# Altium schematic sheet 原理圖.schdoc
size 420 x 410 mm
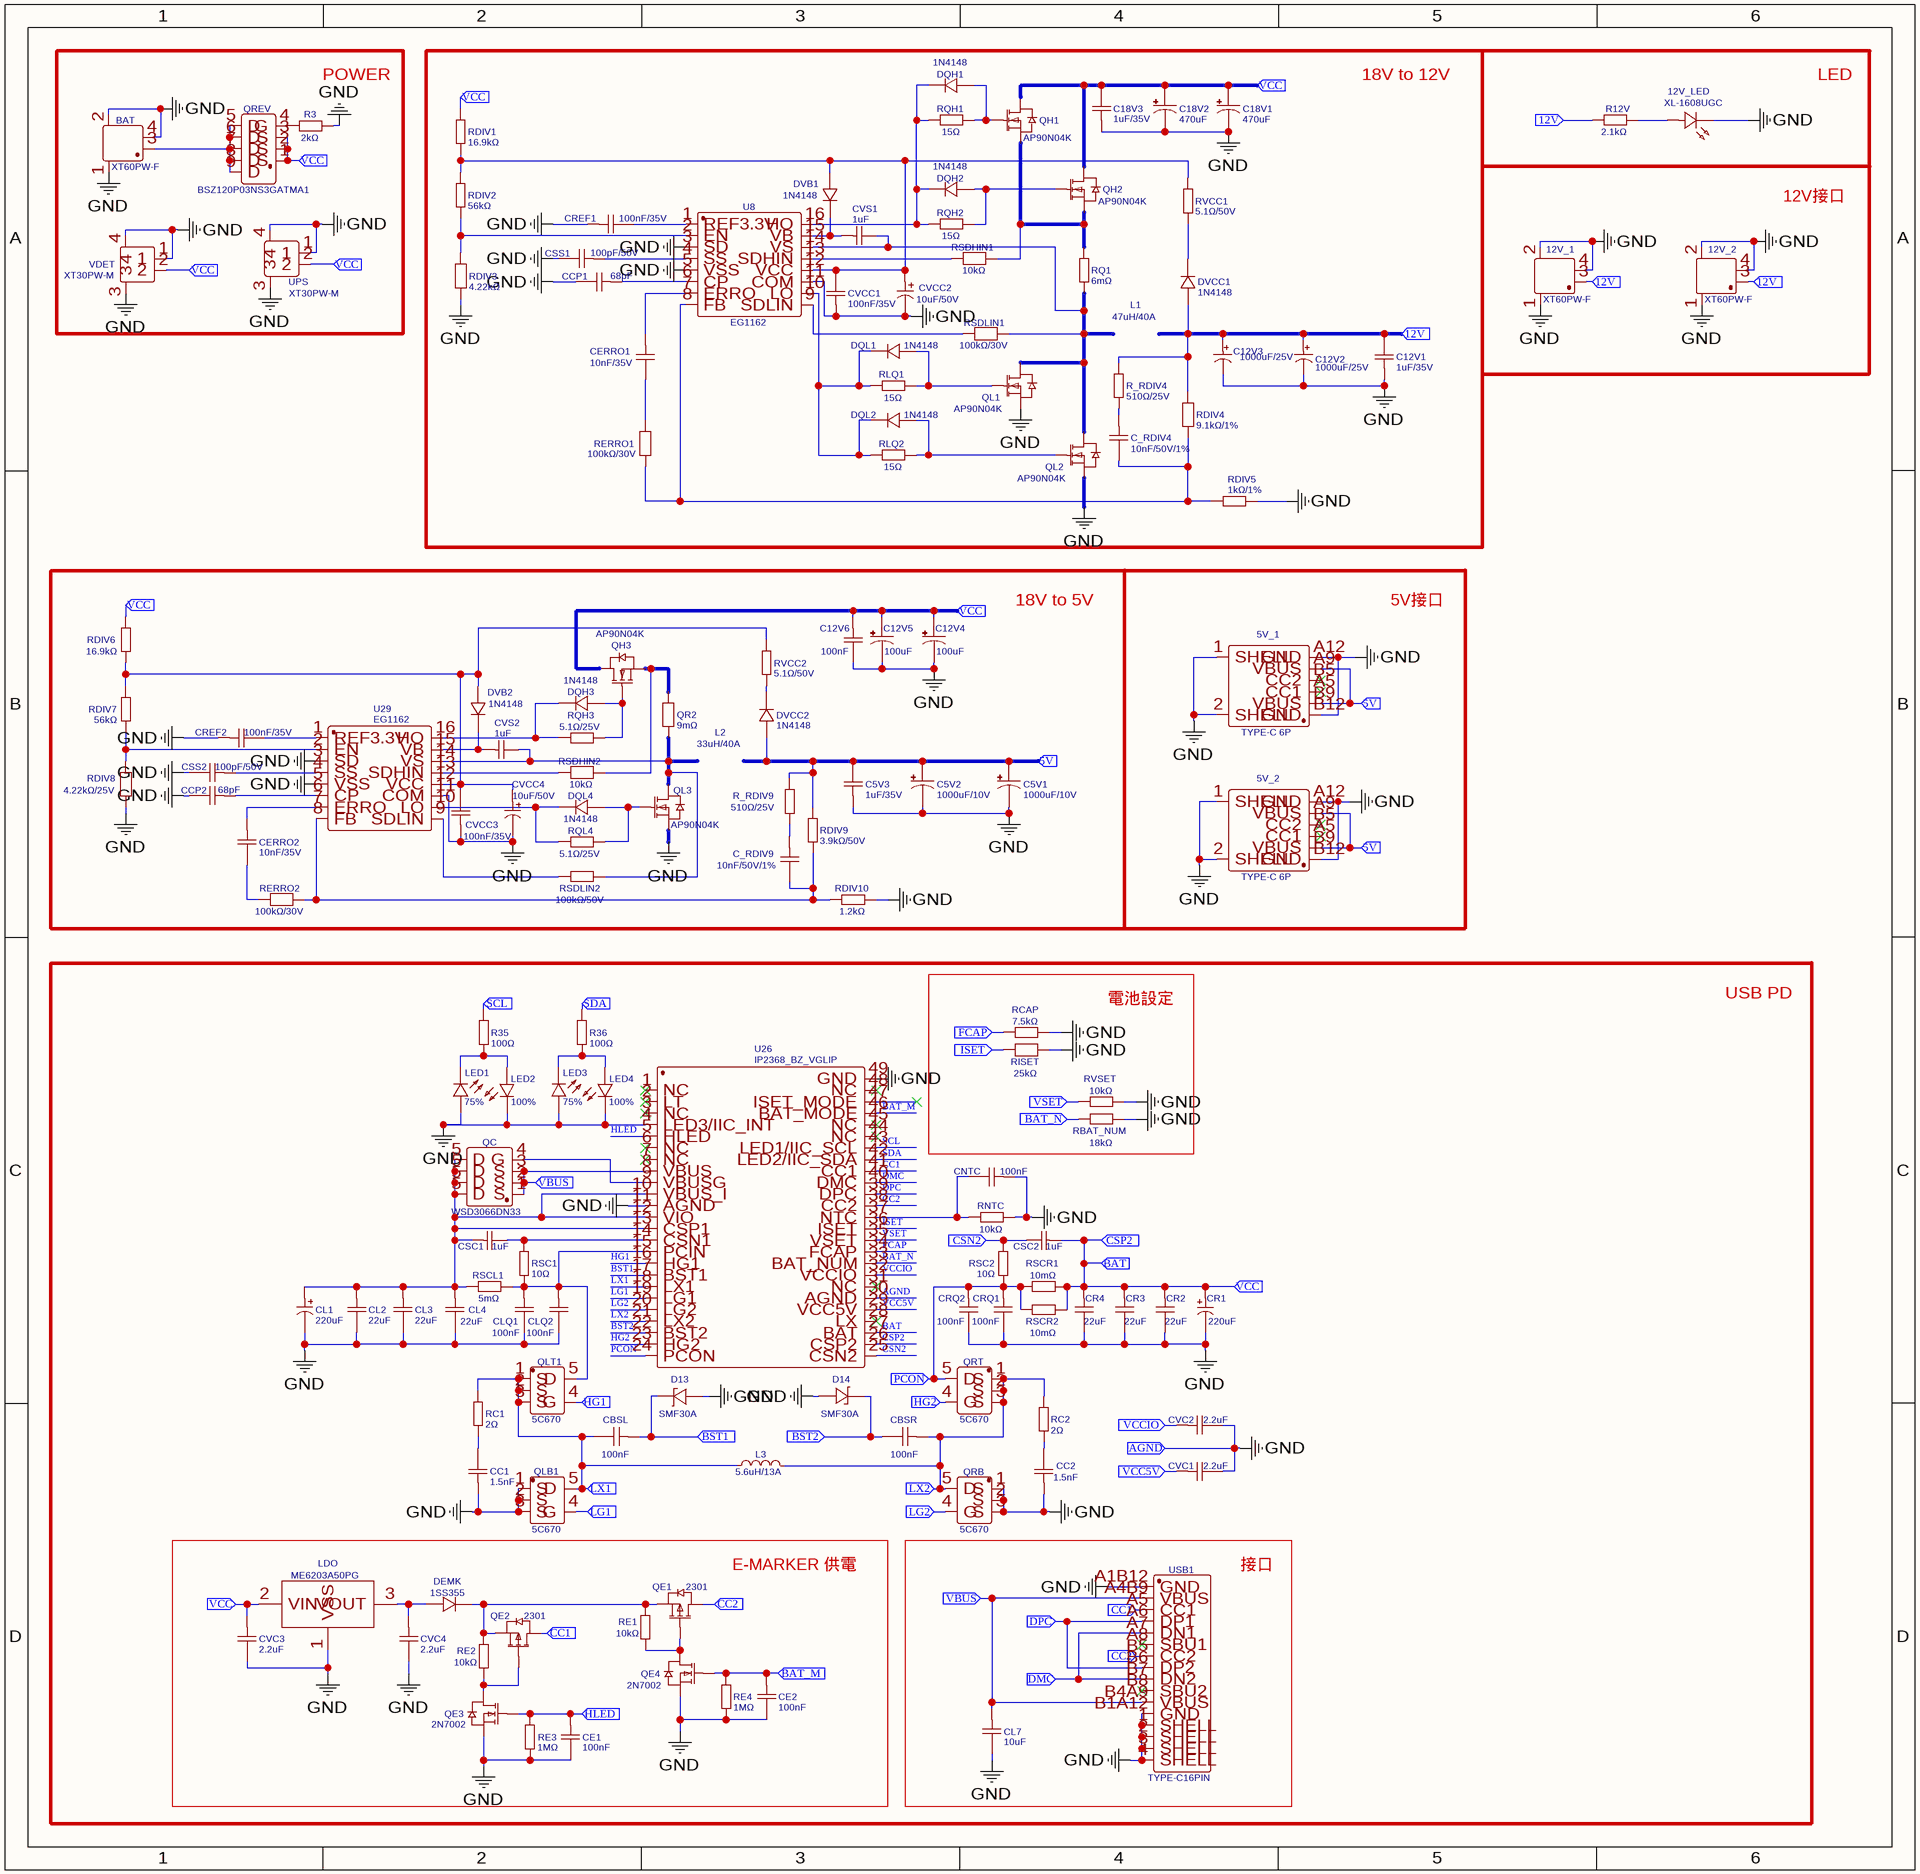
[diagram p0: 原理圖.schdoc]

## Parts
5V_1  TYPE-C 6P  [USB-C-SMD_TYPE-C-6P]
5V_2  TYPE-C 6P  [USB-C-SMD_TYPE-C-6P]
12V_1  XT60PW-F  [TH_2P-XT60PW-F]
12V_2  XT60PW-F  [TH_2P-XT60PW-F]
12V_LED  XL-1608UGC  [LED0603-RD_GREEN]
BAT  XT60PW-F  [TH_2P-XT60PW-F]
C5V1  1000uF/10V  [CAP-SMD_BD8.0-L8.3-W8.3-LS9.1-FD]
C5V2  1000uF/10V  [CAP-SMD_BD8.0-L8.3-W8.3-LS9.1-FD]
C5V3  1uF/35V  [C0805]
C12V1  1uF/35V  [C0805]
C12V2  1000uF/25V  [CAP-TH_BD10.0-P5.00-D1.0-FD]
C12V3  1000uF/25V  [CAP-TH_BD10.0-P5.00-D1.0-FD]
C12V4  100uF  [CAP-SMD_BD6.3-L6.6-W6.6-FD]
C12V5  100uF  [CAP-SMD_BD6.3-L6.6-W6.6-FD]
C12V6  100nF  [C0603]
C18V1  470uF  [CAP-SMD_BD10.0-L10.3-W10.3-FD]
C18V2  470uF  [CAP-SMD_BD10.0-L10.3-W10.3-FD]
C18V3  1uF/35V  [C0805]
C_RDIV4  10nF/50V/1%  [C0603]
C_RDIV9  10nF/50V/1%  [C0603]
CBSL  100nF  [C0603]
CBSR  100nF  [C0603]
CC1  1.5nF  [C0402]
CC2  1.5nF  [C0402]
CCP1  68pF  [C0402]
CCP2  68pF  [C0402]
CE1  100nF  [C0402]
CE2  100nF  [C0402]
CERRO1  10nF/35V  [C0402]
CERRO2  10nF/35V  [C0402]
CL1  220uF  [CAP-TH_BD8.0-P3.50-D0.6-FD]
CL2  22uF  [C1210]
CL3  22uF  [C1210]
CL4  22uF  [C1210]
CL7  10uF  [C1206]
CLQ1  100nF  [C0402]
CLQ2  100nF  [C0402]
CNTC  100nF  [C0603]
CR1  220uF  [CAP-TH_BD8.0-P3.50-D0.6-FD]
CR2  22uF  [C1210]
CR3  22uF  [C1210]
CR4  22uF  [C1210]
CREF1  100nF/35V  [C0402]
CREF2  100nF/35V  [C0402]
CRQ1  100nF  [C0402]
CRQ2  100nF  [C0402]
CSC1  1uF  [C0402]
CSC2  1uF  [C0402]
CSS1  100pF/50V  [C0603]
CSS2  100pF/50V  [C0603]
CVC1  2.2uF  [C0402]
CVC2  2.2uF  [C0402]
CVC3  2.2uF  [C0402]
CVC4  2.2uF  [C0402]
CVCC1  100nF/35V  [C0402]
CVCC2  10uF/50V  [CAP-SMD_BD5.0-L5.3-W5.3-LS6.0-FD]
CVCC3  100nF/35V  [C0402]
CVCC4  10uF/50V  [CAP-SMD_BD5.0-L5.3-W5.3-FD]
CVS1  1uF  [C0201]
CVS2  1uF  [C0201]
D13  SMF30A  [SOD-123_L2.6-W1.6-LS3.5-RD]
D14  SMF30A  [SOD-123_L2.6-W1.6-LS3.5-RD]
DEMK  1SS355  [SOD-323F_L1.7-W1.3-LS2.5-RD]
DQH1  1N4148  [SOD-523_L1.2-W0.8-LS1.6-RD]
DQH2  1N4148  [SOD-523_L1.2-W0.8-LS1.6-RD]
DQH3  1N4148  [SOD-523_L1.2-W0.8-LS1.6-RD]
DQL1  1N4148  [SOD-523_L1.2-W0.8-LS1.6-RD]
DQL2  1N4148  [SOD-523_L1.2-W0.8-LS1.6-RD]
DQL4  1N4148  [SOD-523_L1.2-W0.8-LS1.6-RD]
DVB1  1N4148  [SOD-523_L1.2-W0.8-LS1.6-RD]
DVB2  1N4148  [SOD-523_L1.2-W0.8-LS1.6-RD]
DVCC1  1N4148  [SOD-523_L1.2-W0.8-LS1.6-RD]
DVCC2  1N4148  [SOD-523_L1.2-W0.8-LS1.6-RD]
L1  47uH/40A  [鐵硅鋁電感]
L2  33uH/40A  [鐵硅鋁電感]
L3  5.6uH/13A  [IND-SMD_L13.4-W12.6]
LDO  ME6203A50PG  [SOT-89_L4.5-W2.5-P1.50-LS4.2-BR]
LED1  75%  [LED0603-RD]
LED2  100%  [LED0603-RD]
LED3  75%  [LED0603-RD]
LED4  100%  [LED0603-RD]
QC  WSD3066DN33  [DFN-8_L3.3-W3.3-P0.65-BL]
QE1  2301  [SOT-23-3_L2.9-W1.3-P1.90-LS2.4-BR]
QE2  2301  [SOT-23-3_L2.9-W1.3-P1.90-LS2.4-BR]
QE3  2N7002  [SOT-23-3_L2.9-W1.3-P1.90-LS2.4-BR]
QE4  2N7002  [SOT-23-3_L2.9-W1.3-P1.90-LS2.4-BR]
QH1  AP90N04K  [TO-252-2_L6.6-W6.1-P4.57-LS9.9-BR-CW]
QH2  AP90N04K  [TO-252-2_L6.6-W6.1-P4.57-LS9.9-BR-CW]
QH3  AP90N04K  [TO-252-2_L6.6-W6.1-P4.57-LS9.9-BR-CW]
QL1  AP90N04K  [TO-252-2_L6.6-W6.1-P4.57-LS9.9-BR-CW]
QL2  AP90N04K  [TO-252-2_L6.6-W6.1-P4.57-LS9.9-BR-CW]
QL3  AP90N04K  [TO-252-2_L6.6-W6.1-P4.57-LS9.9-BR-CW]
QLB1  5C670  [DFN-5_L6.1-W5.1-P1.27-BL]
QLT1  5C670  [DFN-5_L6.1-W5.1-P1.27-BL]
QR2  9mΩ  [R0805]
QRB  5C670  [DFN-5_L6.1-W5.1-P1.27-BL]
QREV  BSZ120P03NS3GATMA1  [PG-TSDSON-8_L3.3-W3.3-P0.65-BL]
QRT  5C670  [DFN-5_L6.1-W5.1-P1.27-BL]
R3  2kΩ  [R0603]
R12V  2.1kΩ  [R0402]
R35  100Ω  [R0603]
R36  100Ω  [R0603]
R_RDIV4  510Ω/25V  [R0201]
R_RDIV9  510Ω/25V  [R0201]
RBAT_NUM  18kΩ  [R0603]
RC1  2Ω  [R0402]
RC2  2Ω  [R0402]
RCAP  7.5kΩ  [R0603]
RDIV1  16.9kΩ  [R0603]
RDIV2  56kΩ  [R0402]
RDIV3  4.22kΩ  [R0201]
RDIV4  9.1kΩ/1%  [R0201]
RDIV5  1kΩ/1%  [R0201]
RDIV6  16.9kΩ  [R0603]
RDIV7  56kΩ  [R0402]
RDIV8  4.22kΩ/25V  [R0201]
RDIV9  3.9kΩ/50V  [R0402]
RDIV10  1.2kΩ  [R0603]
RE1  10kΩ  [R0201]
RE2  10kΩ  [R0201]
RE3  1MΩ  [R0201]
RE4  1MΩ  [R0201]
RERRO1  100kΩ/30V  [R0201]
RERRO2  100kΩ/30V  [R0201]
RISET  25kΩ  [R0603]
RLQ1  15Ω  [R0201]
RLQ2  15Ω  [R0201]
RNTC  10kΩ  [R0603]
RQ1  6mΩ  [RES-SMD_L6.4-W3.2]
RQH1  15Ω  [R0201]
RQH2  15Ω  [R0201]
RQH3  5.1Ω/25V  [R0201]
RQL4  5.1Ω/25V  [R0201]
RSC1  10Ω  [R0402]
RSC2  10Ω  [R0402]
RSCL1  5mΩ  [RES-SMD_L3.2-W1.6_PA1206]
RSCR1  10mΩ  [R1206]
RSCR2  10mΩ  [R1206]
RSDHIN1  10kΩ  [R0201]
RSDHIN2  10kΩ  [R0201]
RSDLIN1  100kΩ/30V  [R0201]
RSDLIN2  100kΩ/50V  [R0402]
RVCC1  5.1Ω/50V  [R0402]
RVCC2  5.1Ω/50V  [R0402]
RVSET  10kΩ  [R0603]
U8  EG1162  [SOP-16_L9.9-W3.9-P1.27-LS6.0-BL]
U26  IP2368_BZ_VGLIP  [QFN-48_L7.0-W7.0-P0.50-TL-EP5.4-1]
U29  EG1162  [SOP-16_L9.9-W3.9-P1.27-LS6.0-BL]
UPS  XT30PW-M  [CONN-TH_XT30PW-M]
USB1  TYPE-C16PIN  [USB-C-SMD_TYPE-C16PIN]
VDET  XT30PW-M  [CONN-TH_XT30PW-M]

## Blocks framed on the sheet
POWER: BAT QREV R3 UPS VDET
18V to 12V: C12V1-C12V3 C18V1-C18V3 C_RDIV4 CCP1 CERRO1 CREF1 CSS1 CVCC1 CVCC2 CVS1 DQH1 DQH2 DQL1 DQL2 DVB1 DVCC1 L1 QH1 QH2 QL1 QL2 R_RDIV4 RDIV1-RDIV5 RERRO1 RLQ1 RLQ2 RQ1 RQH1 RQH2 RSDHIN1 RSDLIN1 RVCC1 U8
LED: 12V_LED R12V
12V接口: 12V_1 12V_2
18V to 5V: C5V1-C5V3 C12V4-C12V6 C_RDIV9 CCP2 CERRO2 CREF2 CSS2 CVCC3 CVCC4 CVS2 DQH3 DQL4 DVB2 DVCC2 L2 QH3 QL3 QR2 R_RDIV9 RDIV6-RDIV10 RERRO2 RQH3 RQL4 RSDHIN2 RSDLIN2 RVCC2 U29
5V接口: 5V_1 5V_2
USB PD: CBSL CBSR CC1 CC2 CL1-CL4 CLQ1 CLQ2 CNTC CR1-CR4 CRQ1 CRQ2 CSC1 CSC2 CVC1 CVC2 D13 D14 L3 LED1-LED4 QC QLB1 QLT1 QRB QRT R35 R36 RC1 RC2 RNTC RSC1 RSC2 RSCL1 RSCR1 RSCR2 U26
電池設定: RBAT_NUM RCAP RISET RVSET
E-MARKER 供電: CE1 CE2 CVC3 CVC4 DEMK LDO QE1-QE4 RE1-RE4
接口: CL7 USB1

## Ports
5V (in), 12V (in), AGND (in), BAT (in), BAT_M (in), BAT_N (in), BST1 (in), BST2 (in), CC1 (in), CC2 (in), CSN2 (in), CSP2 (in), DMC (in), DPC (in), FCAP (in), HG1 (in), HG2 (in), HLED (in), ISET (in), LG1 (in), LG2 (in), LX1 (in), LX2 (in), PCON (in), SCL (in), SDA (in), VBUS (in), VCC5V (in), VCC (in), VCCIO (in), VSET (in)

## Nets
GND: 5V_1.1(SHELL) 5V_1.2(SHELL) 5V_1.A12(GND) 5V_1.B12(GND) 5V_2.1(SHELL) 5V_2.2(SHELL) 5V_2.A12(GND) 5V_2.B12(GND) 12V_1.1 12V_1.2 12V_1.4 12V_2.1 12V_2.2 12V_2.4 12V_LED.1(K) BAT.1 BAT.2 BAT.4 C5V1.2 C5V2.2 C5V3.2 C12V1.2 C12V2.2 C12V3.2 C12V4.2 C12V5.2 C12V6.1 C18V1.2 C18V2.2 C18V3.2 CC1.2 CC2.2 CCP1.1 CCP2.1 CE1.1 CE2.1 CL1.2 CL2.1 CL3.1 CL4.1 CL7.1 CLQ1.1 CLQ2.1 CNTC.2 CR1.2 CR2.1 CR3.1 CR4.1 CREF1.2 CREF2.2 CRQ1.1 CRQ2.1 CSS1.1 CSS2.1 CVC1.1 CVC2.1 CVC3.1 CVC4.1 CVCC1.2 CVCC2.2 CVCC3.2 CVCC4.2 D13.2(A) D14.2(A) LDO.1(VSS) LED1.2(+) LED2.1(-) LED3.2(+) LED4.1(-) QE3.2(S) QE4.2(S) QL1.3(S) QL2.3(S) QL3.3(S) QLB1.1(S) QLB1.2(S) QLB1.3(S) QRT.1(S) QRT.2(S) QRT.3(S) R3.1 RBAT_NUM.2 RCAP.2 RDIV3.1 RDIV5.2 RDIV8.1 RDIV10.1 RE3.2 RE4.2 RISET.2 RNTC.2 RVSET.2 U8.3(SD) U8.5(VSS) U8.11(COM) U26.4(LED3/IIC_INT) U26.11(AGND) U26.49(GND) U29.3(SD) U29.5(VSS) U29.11(COM) UPS.1 UPS.3 UPS.4 USB1.1(SHELL) USB1.2(SHELL) USB1.3(SHELL) USB1.4(SHELL) USB1.A1B12(GND) USB1.B1A12(GND) VDET.1 VDET.3 VDET.4 ; port AGND
5V: 5V_1.A9(VBUS) 5V_1.B9(VBUS) 5V_2.A9(VBUS) 5V_2.B9(VBUS) C5V1.1 C5V2.1 C5V3.1 DVCC2.2(A) L2.2 R_RDIV9.2 RDIV9.2 ; port 5V
12V: 12V_1.3 12V_2.3 C12V1.1 C12V2.1 C12V3.1 DVCC1.2(A) L1.2 R12V.1 R_RDIV4.2 RDIV4.2 ; port 12V
AGND: U26.30(AGND)
BAT: C12V4.1 C12V5.1 C12V6.2 C18V1.1 C18V2.1 C18V3.1 CR1.1 CR2.2 CR3.2 CR4.2 CSC2.1 CVC3.2 LDO.2(VIN) QH1.2(D) QH2.2(D) QH3.2(D) QREV.1(S) QREV.2(S) QREV.3(S) RDIV1.2 RDIV6.1 RSCR1.2 RSCR2.2 UPS.2 VDET.2 ; port VCC, port CSP2, port BAT
BAT: U26.27(BAT)  [a separate net that carries the same name]
BAT_M: U26.46(BAT_MODE)
BAT_M: CE2.2 QE4.1(G) RE4.1 ; port BAT_M  [a separate net that carries the same name]
BAT_N: U26.33(BAT_NUM)
BAT_N: RBAT_NUM.1 ; port BAT_N  [a separate net that carries the same name]
BST1: CBSL.2 D13.1(K) ; port BST1
BST1: U26.17(BST1)  [a separate net that carries the same name]
BST2: U26.22(BST2)
BST2: CBSR.1 D14.1(K) ; port BST2  [a separate net that carries the same name]
CC1: U26.41(CC1)
CC1: QE2.3(D) USB1.A5(CC1) ; port CC1  [a separate net that carries the same name]
CC2: U26.38(CC2)
CC2: QE1.3(D) USB1.B5(CC2) ; port CC2  [a separate net that carries the same name]
CSN2: U26.25(CSN2)
CSN2: CSC2.2 RSC2.2 ; port CSN2  [a separate net that carries the same name]
CSP2: U26.26(CSP2)
DMC: U26.40(DMC)
DMC: USB1.A7(DN1) USB1.B7(DN2) ; port DMC  [a separate net that carries the same name]
DPC: U26.39(DPC)
DPC: USB1.A6(DP1) USB1.B6(DP2) ; port DPC  [a separate net that carries the same name]
FCAP: U26.34(FCAP)
FCAP: RCAP.1 ; port FCAP  [a separate net that carries the same name]
HG1: QLT1.4(G) ; port HG1
HG1: U26.16(HG1)  [a separate net that carries the same name]
HG2: U26.23(HG2)
HG2: QRB.4(G) ; port HG2  [a separate net that carries the same name]
HLED: U26.5(HLED)
HLED: CE1.2 QE3.1(G) RE3.1 ; port HLED  [a separate net that carries the same name]
ISET: U26.36(ISET)
ISET: RISET.1 ; port ISET  [a separate net that carries the same name]
LG1: QLB1.4(G) ; port LG1
LG1: U26.19(LG1)  [a separate net that carries the same name]
LG2: U26.20(LG2)
LG2: QRT.4(G) ; port LG2  [a separate net that carries the same name]
LX1: CBSL.1 L3.1 QLB1.5(D) QLT1.1(S) QLT1.2(S) QLT1.3(S) RC1.1 ; port LX1
LX1: U26.18(LX1)  [a separate net that carries the same name]
LX2: U26.21(LX2)
LX2: CBSR.2 L3.2 QRB.1(S) QRB.2(S) QRB.3(S) QRT.5(D) RC2.1 ; port LX2  [a separate net that carries the same name]
PCON: U26.24(PCON)
PCON: CRQ1.2 CRQ2.2 QRB.5(D) RSC2.1 RSCR1.1 RSCR2.1 ; port PCON  [a separate net that carries the same name]
SCL: R35.2 ; port SCL
SCL: U26.43(LED1/IIC_SCL)  [a separate net that carries the same name]
SDA: R36.2 ; port SDA
SDA: U26.42(LED2/IIC_SDA)  [a separate net that carries the same name]
VBUS: CL7.2 QC.1(S) QC.2(S) QC.3(S) U26.8(VBUS) USB1.A4B9(VBUS) USB1.B4A9(VBUS) ; port VBUS
VCC5V: U26.29(VCC5V)
VCC5V: CVC1.2 ; port VCC5V  [a separate net that carries the same name]
VCCIO: U26.32(VCCIO)
VCCIO: CVC2.2 ; port VCCIO  [a separate net that carries the same name]
VSET: U26.35(VSET)
VSET: RVSET.1 ; port VSET  [a separate net that carries the same name]
Net12V_LED_2: 12V_LED.2(A) R12V.2
NetBAT_3: BAT.3 QREV.5(D) QREV.6(D) QREV.7(D) QREV.8(D) QREV.9(D)
NetC_RDIV4_1: C_RDIV4.1 RDIV4.1 RDIV5.1 RERRO1.1 U8.8(FB)
NetC_RDIV4_2: C_RDIV4.2 R_RDIV4.1
NetC_RDIV9_1: C_RDIV9.1 RDIV9.1 RDIV10.2 RERRO2.1 U29.8(FB)
NetC_RDIV9_2: C_RDIV9.2 R_RDIV9.1
NetCC1_1: CC1.1 RC1.2
NetCC2_1: CC2.1 RC2.2
NetCCP1_2: CCP1.2 U8.6(CP)
NetCCP2_2: CCP2.2 U29.6(CP)
NetCERRO1_1: CERRO1.1 RERRO1.2
NetCERRO1_2: CERRO1.2 U8.7(ERRO)
NetCERRO2_1: CERRO2.1 RERRO2.2
NetCERRO2_2: CERRO2.2 U29.7(ERRO)
NetCL1_1: CL1.1 CL2.2 CL3.2 CL4.2 CSC1.1 QC.5(D) RSCL1.1 U26.10(VBUS_I) U26.12(VIO) U26.13(CSP1)
NetCLQ1_2: CLQ1.2 CLQ2.2 QLT1.5(D) RSC1.1 RSCL1.2 U26.15(PCIN)
NetCNTC_1: CNTC.1 RNTC.1 U26.37(NTC)
NetCREF1_1: CREF1.1 U8.1(REF3.3V)
NetCREF2_1: CREF2.1 U29.1(REF3.3V)
NetCSC1_2: CSC1.2 RSC1.2 U26.14(CSN1)
NetCSS1_2: CSS1.2 U8.4(SS)
NetCSS2_2: CSS2.2 U29.4(SS)
NetCVC4_2: CVC4.2 DEMK.2(A) LDO.3(VOUT)
NetCVCC1_1: CVCC1.1 CVCC2.1 DVB1.2(A) RDIV1.1 RDIV2.2 RVCC1.2 U8.12(VCC)
NetCVCC3_1: CVCC3.1 CVCC4.1 DVB2.2(A) RDIV6.2 RDIV7.2 RVCC2.2 U29.12(VCC)
NetCVS1_1: CVS1.1 DVB1.1(K) U8.15(VB)
NetCVS1_2: CVS1.2 L1.1 QL1.2(D) QL2.2(D) RQ1.1 RSDLIN1.2 U8.14(VS)
NetCVS2_1: CVS2.1 DVB2.1(K) U29.15(VB)
NetCVS2_2: CVS2.2 L2.1 QL3.2(D) QR2.1 RSDLIN2.2 U29.14(VS)
NetDEMK_1: DEMK.1(C) QE1.2(S) QE2.2(S) RE1.2 RE2.2
NetDQH1_1: DQH1.1(K) DQH2.1(K) RQH1.1 RQH2.1 U8.16(HO)
NetDQH1_2: DQH1.2(A) QH1.1(G) RQH1.2
NetDQH2_2: DQH2.2(A) QH2.1(G) RQH2.2
NetDQH3_1: DQH3.1(K) RQH3.1 U29.16(HO)
NetDQH3_2: DQH3.2(A) QH3.1(G) RQH3.2
NetDQL1_1: DQL1.1(K) DQL2.1(K) RLQ1.1 RLQ2.1 U8.10(LO)
NetDQL1_2: DQL1.2(A) QL1.1(G) RLQ1.2
NetDQL2_2: DQL2.2(A) QL2.1(G) RLQ2.2
NetDQL4_1: DQL4.1(K) RQL4.1 U29.10(LO)
NetDQL4_2: DQL4.2(A) QL3.1(G) RQL4.2
NetDVCC1_1: DVCC1.1(K) RVCC1.1
NetDVCC2_1: DVCC2.1(K) RVCC2.1
NetLED1_1: LED1.1(-) LED2.2(+) R35.1
NetLED3_1: LED3.1(-) LED4.2(+) R36.1
NetQC_4: QC.4(G) U26.9(VBUSG)
NetQE1_1: QE1.1(G) QE4.3(D) RE1.1
NetQE2_1: QE2.1(G) QE3.3(D) RE2.1
NetQH1_3: QH1.3(S) QH2.3(S) RQ1.2 RSDHIN1.2
NetQH3_3: QH3.3(S) QR2.2 RSDHIN2.2
NetQREV_4: QREV.4(G) R3.2
NetRDIV2_1: RDIV2.1 RDIV3.2 U8.2(EN)
NetRDIV7_1: RDIV7.1 RDIV8.2 U29.2(EN)
NetRSDHIN1_1: RSDHIN1.1 U8.13(SDHIN)
NetRSDHIN2_1: RSDHIN2.1 U29.13(SDHIN)
NetRSDLIN1_1: RSDLIN1.1 U8.9(SDLIN)
NetRSDLIN2_1: RSDLIN2.1 U29.9(SDLIN)

Not connected (* = marked no-connect by the designer): 5V_1 A5(CC1)* B5(CC2)*; 5V_2 A5(CC1)* B5(CC2)*; U26 1(NC)* 2(LT)* 3(NC)* 6(NC)* 7(NC)* 28(LX)* 31(NC)* 44(NC)* 45(NC)* 47(ISET_MODE)* 48(NC)*; USB1 A8(SBU1)* B8(SBU2)*

## Library data of the parts
5V_1 5V_2 = TYPE-C 6P: Manufacturer: SHOU HAN(首韩); Manufacturer Part: TYPE-C 6P(040新); Contributor: LCSC; Supplier: LCSC; Supplier Part: C2887422; JLCPCB Part Class: Extended Part; spicePre: U; spiceSymbolName: TYPE-C 6P(040新)
12V_1 12V_2 BAT = XT60PW-F: Manufacturer: AMASS(艾迈斯); Contributor: lcsc; Supplier: LCSC; Supplier Part: C428722; Manufacturer Part: XT60PW-F; JLCPCB Part Class: Extended Part; spicePre: U; spiceSymbolName: XT60PW-F_C428722
12V_LED = XL-1608UGC: Manufacturer: XINGLIGHT(成兴光); Manufacturer Part: XL-1608UGC-04; Contributor: lcsc; Supplier: LCSC; Supplier Part: C965804; JLCPCB Part Class: Extended Part; spicePre: L; spiceSymbolName: XL-1608UGC-04
C5V1 C5V2 = 1000uF/10V: Manufacturer: ROQANG(容强); Manufacturer Part: RT1A102M0810; nameAlias: Value; Contributor: LCSC; Supplier: LCSC; Supplier Part: C280406; spicePre: C; spiceSymbolName: RT1A102M0810
C5V3 C12V1 C18V3 = 1uF/35V: Manufacturer: muRata(村田); Manufacturer Part: GRM219R7YA105KA12D; nameAlias: Value; Contributor: LCSC; Supplier: LCSC; Supplier Part: C440196; JLCPCB Part Class: Extended Part; spicePre: C; spiceSymbolName: GRM219R7YA105KA12D
C12V2 C12V3 = 1000uF/25V: Manufacturer: CX(承兴); Manufacturer Part: KM108M025G17RR0VH2FP0; nameAlias: Value; Supplier: LCSC; Supplier Part: C10750; JLCPCB Part Class: Extended Part; spicePre: C; spiceSymbolName: 1000uF 25V
C12V4 C12V5 = 100uF: Manufacturer: PANASONIC(松下); Manufacturer Part: EEHZA1E101XP; nameAlias: Value; Contributor: LCSC; Supplier: LCSC; Supplier Part: C264047; JLCPCB Part Class: Extended Part; spicePre: C; spiceSymbolName: EEHZA1E101XP
C12V6 = 100nF: Manufacturer: YAGEO(国巨); Manufacturer Part: CC0603KRX7R9BB104; nameAlias: Value; Supplier: LCSC; Supplier Part: C14663; JLCPCB Part Class: Basic Part; spicePre: C; spiceSymbolName: CC0603KRX7R9BB104
C18V1 C18V2 = 470uF: Manufacturer: PANASONIC(松下); Manufacturer Part: EEHZS1V471P; nameAlias: Value; Contributor: LCSC; Supplier: LCSC; Supplier Part: C403803; JLCPCB Part Class: Extended Part; spicePre: C; spiceSymbolName: EEHZS1V471P
C_RDIV4 C_RDIV9 = 10nF/50V/1%: Manufacturer: muRata(村田); Manufacturer Part: GRM1885C1H103FA01D; nameAlias: Value; Contributor: lcsc; Supplier: LCSC; Supplier Part: C5299898; JLCPCB Part Class: Extended Part; link: https://lcsc.com/eda_search?q=C5299898&%26type=1&ref=editor; spicePre: U; spiceSymbolName: GRM1885C1H103FA01D
CBSL CBSR CNTC = 100nF: Manufacturer: SAMSUNG(三星); Manufacturer Part: CL10B104KC8NNNC; nameAlias: Value; Supplier: LCSC; Supplier Part: C15725; JLCPCB Part Class: Extended Part; spicePre: C; spiceSymbolName: CL10B104KC8NNNC
CC1 CC2 = 1.5nF: Manufacturer: SAMSUNG(三星); Manufacturer Part: CL05B152KB5NNNC; nameAlias: Value; Supplier: LCSC; Supplier Part: C23967; JLCPCB Part Class: Extended Part; spicePre: C; spiceSymbolName: CL05B152KB5NNNC
CCP1 CCP2 = 68pF: Manufacturer: muRata(村田); Manufacturer Part: GRM1555C1H680FA01D; nameAlias: Value; Contributor: LCSC; Supplier: LCSC; Supplier Part: C162117; JLCPCB Part Class: Extended Part; spicePre: C; spiceSymbolName: GRM1555C1H680FA01D
CE1 CE2 CLQ1 CLQ2 CRQ1 CRQ2 = 100nF: Manufacturer: SANYEAR(叁叶源); Manufacturer Part: C0402X5R104K101NT; nameAlias: Value; Contributor: lcsc; Supplier: LCSC; Supplier Part: C2891985; JLCPCB Part Class: Extended Part; spicePre: C; spiceSymbolName: C0402X5R104K101NT
CERRO1 CERRO2 = 10nF/35V: Manufacturer: muRata(村田); Manufacturer Part: GRM1555CYA103JE01D; nameAlias: Value; Contributor: lcsc; Supplier: LCSC; Supplier Part: C1518210; JLCPCB Part Class: Extended Part; spicePre: U; spiceSymbolName: GRM1555CYA103JE01D
CL1 CR1 = 220uF: Manufacturer: AISHI(艾华集团); Manufacturer Part: SPZ1VM221F11O00RAXXX; nameAlias: Value; Contributor: lcsc; Supplier: LCSC; Supplier Part: C2688260; JLCPCB Part Class: Extended Part; spicePre: C; spiceSymbolName: SPZ1VM221F11O00RAXXX
CL2-CL4 CR2-CR4 = 22uF: Manufacturer: TAIYO YUDEN(太诱); Manufacturer Part: GMK325BJ226MM-P; nameAlias: Value; Contributor: lcsc; Supplier: LCSC; Supplier Part: C778721; JLCPCB Part Class: Extended Part; spicePre: U; spiceSymbolName: GMK325BJ226MM-P
CL7 = 10uF: Manufacturer: TDK; Manufacturer Part: CGA5L1X7R1E106KT0Y0E; nameAlias: Value; Contributor: LCSC; Supplier: LCSC; Supplier Part: C76715; JLCPCB Part Class: Extended Part; spicePre: C; spiceSymbolName: CGA5L1X7R1E106KT0Y0E
CREF1 CREF2 = 100nF/35V: Manufacturer: TDK; Manufacturer Part: CGA2B3X7R1V104K050BB; Contributor: lcsc; nameAlias: Value; Supplier: LCSC; Supplier Part: C2181802; JLCPCB Part Class: Extended Part; spicePre: C; spiceSymbolName: CGA2B3X7R1V104K050BB
CSC1 CSC2 = 1uF: Manufacturer Part: CL05A105KO5NNNC; Manufacturer: SAMSUNG(三星); nameAlias: Value; Supplier: LCSC; Supplier Part: C29266; JLCPCB Part Class: Extended Part; spicePre: C; spiceSymbolName: CL05A105KO5NNNC
CSS1 CSS2 = 100pF/50V: Manufacturer: Kyocera AVX; Manufacturer Part: 06035C101KAT2A; nameAlias: Value; Contributor: LCSC; Supplier: LCSC; Supplier Part: C597182; JLCPCB Part Class: Extended Part; spicePre: C; spiceSymbolName: 06035C101KAT2A
CVC1-CVC4 = 2.2uF: Manufacturer: muRata(村田); Manufacturer Part: GRM155R6YA225KE11D; nameAlias: Value; Contributor: LCSC; Supplier: LCSC; Supplier Part: C237392; JLCPCB Part Class: Extended Part; spicePre: C; spiceSymbolName: GRM155R6YA225KE11D
CVCC1 CVCC3 = 100nF/35V: Manufacturer: TDK; Manufacturer Part: CGA2B3X7R1V104KT0Y0F; Contributor: lcsc; nameAlias: Value; Supplier: LCSC; Supplier Part: C343047; JLCPCB Part Class: Extended Part; spicePre: U; spiceSymbolName: CGA2B3X7R1V104KT0Y0F
CVCC2 = 10uF/50V: Manufacturer: PANASONIC(松下); Manufacturer Part: EEHZA1H100R; nameAlias: Value; Contributor: lcsc; Supplier: LCSC; Supplier Part: C454364; JLCPCB Part Class: Extended Part; spicePre: C; spiceSymbolName: EEHZA1H100R
CVCC4 = 10uF/50V: Manufacturer: KNSCHA(科尼盛); Manufacturer Part: RST10UF50V016; nameAlias: Value; Contributor: lcsc; Supplier: LCSC; Supplier Part: C4747971; JLCPCB Part Class: Extended Part; spicePre: C; spiceSymbolName: RST10UF50V016
CVS1 CVS2 = 1uF: Manufacturer Part: GRM033R61A105ME44D; Manufacturer: muRata(村田); nameAlias: Value; Supplier: LCSC; Supplier Part: C76935; JLCPCB Part Class: Extended Part; link: https://lcsc.com/eda_search?q=C76935&%26type=1&ref=editor; spicePre: C; spiceSymbolName: GRM033R61A105ME44D
D13 D14 = SMF30A: Manufacturer: MDD; Contributor: LCSC; Supplier: LCSC; Supplier Part: C364281; Manufacturer Part: SMF30A; JLCPCB Part Class: Extended Part; spicePre: D; spiceSymbolName: SMF30A_C364281
DEMK = 1SS355: Manufacturer: TC(德昌); Contributor: LCSC; Supplier: LCSC; Supplier Part: C248793; Manufacturer Part: 1SS355; JLCPCB Part Class: Extended Part; spicePre: D; spiceSymbolName: 1SS355_C248793
DQH1-DQH3 DQL1 DQL2 DQL4 DVB1 DVB2 DVCC1 DVCC2 = 1N4148: Manufacturer: DIODES(美台); Manufacturer Part: 1N4148WT-7; Supplier: LCSC; Supplier Part: C83482; JLCPCB Part Class: Extended Part; spicePre: D; spiceSymbolName: 1N4148WT-7
L1 = 47uH/40A: nameAlias: Model; catid: 20; Contributor: EasyEDA; Value: 1m; spicePre: L; spiceSymbolName: Inductor_3D
L2 = 33uH/40A: nameAlias: Model; catid: 20; Contributor: EasyEDA; Value: 1m; spicePre: L; spiceSymbolName: Inductor_3D
L3 = 5.6uH/13A: Manufacturer: Sunlord(顺络); Manufacturer Part: MWSA1206S-5R6MT; nameAlias: Value; Contributor: LCSC; Supplier: LCSC; Supplier Part: C408522; JLCPCB Part Class: Extended Part; spicePre: L; spiceSymbolName: MWSA1206S-5R6MT
LDO = ME6203A50PG: Manufacturer: MICRONE(南京微盟); Supplier: LCSC; Manufacturer Part: ME6203A50PG; Supplier Part: C94056; JLCPCB Part Class: Extended Part; spicePre: U; spiceSymbolName: ME6203A50PG
LED1 LED3 = 75%: Manufacturer: 国星光电; Manufacturer Part: NCD0603W1; Supplier: LCSC; Supplier Part: C84265; JLCPCB Part Class: Extended Part; spicePre: L; spiceSymbolName: FC-D1608WD-460H5
LED2 LED4 = 100%: Manufacturer: 国星光电; Manufacturer Part: NCD0603W1; Supplier: LCSC; Supplier Part: C84265; JLCPCB Part Class: Extended Part; spicePre: L; spiceSymbolName: FC-D1608WD-460H5
QC = WSD3066DN33: Manufacturer: WINSOK(微硕); Contributor: LCSC; Supplier: LCSC; Supplier Part: C148386; Manufacturer Part: WSD3066DN33; JLCPCB Part Class: Extended Part; spicePre: Q; spiceSymbolName: WSD3066DN33
QE1 QE2 = 2301: Manufacturer: FM(富满); Supplier: LCSC; Manufacturer Part: 2301; Supplier Part: C86773; JLCPCB Part Class: Extended Part; spicePre: Q; spiceSymbolName: 2301
QE3 QE4 = 2N7002: Manufacturer: CJ(江苏长电/长晶); Supplier: LCSC; Manufacturer Part: 2N7002; Supplier Part: C8545; JLCPCB Part Class: Basic Part; spicePre: Q; spiceSymbolName: 2N7002
QH1-QH3 QL1-QL3 = AP90N04K: Manufacturer: ALLPOWER(铨力); Contributor: lcsc; Supplier: LCSC; Supplier Part: C5198074; Manufacturer Part: AP90N04K; JLCPCB Part Class: Extended Part; spicePre: U; spiceSymbolName: AP90N04K
QLB1 QLT1 QRB QRT = 5C670: Manufacturer: onsemi(安森美); Manufacturer Part: NTMFS5C670NLT1G; Contributor: LCSC; Supplier: LCSC; Supplier Part: C179626; JLCPCB Part Class: Extended Part; spicePre: Q; spiceSymbolName: NTMFS5C670NLT1G
QR2 = 9mΩ: Manufacturer: 大毅科技; Manufacturer Part: RLM10FTSMR009; nameAlias: Value; Contributor: lcsc; Supplier: LCSC; Supplier Part: C912551; JLCPCB Part Class: Extended Part; spicePre: U; spiceSymbolName: RLM10FTSMR009
QREV = BSZ120P03NS3GATMA1: Manufacturer: Infineon(英飞凌); Contributor: lcsc; Supplier: LCSC; Supplier Part: C5581629; Manufacturer Part: BSZ120P03NS3GATMA1; JLCPCB Part Class: Extended Part; spicePre: U; spiceSymbolName: BSZ120P03NS3GATMA1
R3 = 2kΩ: Manufacturer: UNI-ROYAL(厚声); Manufacturer Part: 0603WAF2001T5E; nameAlias: Value; Supplier: LCSC; Supplier Part: C22975; JLCPCB Part Class: Basic Part; spicePre: R; spiceSymbolName: 0603WAF2001T5E
R12V = 2.1kΩ: Manufacturer Part: RTT022101FTH; Manufacturer: RALEC(旺诠); nameAlias: Value; Supplier: LCSC; Supplier Part: C11508; JLCPCB Part Class: Extended Part; spicePre: R; spiceSymbolName: RTT022101FTH
R35 R36 = 100Ω: Manufacturer: YAGEO(国巨); Manufacturer Part: RC0603FR-07100RL; nameAlias: Value; Supplier: LCSC; Supplier Part: C105588; JLCPCB Part Class: Extended Part; spicePre: R; spiceSymbolName: RC0603FR-07100RL
R_RDIV4 R_RDIV9 = 510Ω/25V: Manufacturer: YAGEO(国巨); Manufacturer Part: AC0201JR-07510RL; nameAlias: Value; Contributor: LCSC; Supplier: LCSC; Supplier Part: C144814; JLCPCB Part Class: Extended Part; spicePre: R; spiceSymbolName: AC0201JR-07510RL
RBAT_NUM = 18kΩ: Manufacturer: UNI-ROYAL(厚声); Manufacturer Part: 0603WAF1802T5E; nameAlias: Value; Supplier: LCSC; Supplier Part: C25810; JLCPCB Part Class: Basic Part; spicePre: R; spiceSymbolName: 0603WAF1802T5E
RC1 RC2 = 2Ω: Manufacturer: UNI-ROYAL(厚声); Manufacturer Part: 0402WGJ020JTCE; nameAlias: Value; Supplier: LCSC; Supplier Part: C25157; JLCPCB Part Class: Extended Part; spicePre: R; spiceSymbolName: 0402WGJ020JTCE
RCAP = 7.5kΩ: Manufacturer: UNI-ROYAL(厚声); Manufacturer Part: 0603WAF7501T5E; nameAlias: Value; Supplier: LCSC; Supplier Part: C23234; JLCPCB Part Class: Basic Part; spicePre: R; spiceSymbolName: 0603WAF7501T5E
RDIV1 RDIV6 = 16.9kΩ: Manufacturer: UNI-ROYAL(厚声); Manufacturer Part: 0603WAF1692T5E; nameAlias: Value; Supplier: LCSC; Supplier Part: C25954; JLCPCB Part Class: Extended Part; spicePre: R; spiceSymbolName: 0603WAF1692T5E
RDIV2 RDIV7 = 56kΩ: Manufacturer: UNI-ROYAL(厚声); Manufacturer Part: 0402WGF5602TCE; nameAlias: Value; Supplier: LCSC; Supplier Part: C25796; JLCPCB Part Class: Extended Part; spicePre: R; spiceSymbolName: 0402WGF5602TCE
RDIV3 = 4.22kΩ: Manufacturer: RALEC(旺诠); Manufacturer Part: RTT014221FTH; Contributor: LCSC; nameAlias: Value; Supplier: LCSC; Supplier Part: C166201; JLCPCB Part Class: Extended Part; spicePre: R; spiceSymbolName: RTT014221FTH
RDIV4 = 9.1kΩ/1%: Manufacturer: UNI-ROYAL(厚声); Manufacturer Part: 0201WMF9101TEE; Contributor: LCSC; nameAlias: Value; Supplier: LCSC; Supplier Part: C423404; JLCPCB Part Class: Extended Part; spicePre: R; spiceSymbolName: 0201WMF9101TEE
RDIV5 = 1kΩ/1%: Manufacturer: UNI-ROYAL(厚声); Manufacturer Part: 0201WMF1001TEE; nameAlias: Value; Contributor: LCSC; Supplier: LCSC; Supplier Part: C270365; JLCPCB Part Class: Extended Part; spicePre: R; spiceSymbolName: 0201WMF1001TEE
RDIV8 = 4.22kΩ/25V: Manufacturer: RALEC(旺诠); Manufacturer Part: RTT014221FTH; Contributor: LCSC; nameAlias: Value; Supplier: LCSC; Supplier Part: C166201; JLCPCB Part Class: Extended Part; spicePre: R; spiceSymbolName: RTT014221FTH
RDIV9 = 3.9kΩ/50V: Manufacturer: UNI-ROYAL(厚声); Manufacturer Part: 0402WGF3901TCE; nameAlias: Value; Supplier: LCSC; Supplier Part: C51721; JLCPCB Part Class: Extended Part; spicePre: R; spiceSymbolName: 0402WGF3901TCE
RDIV10 = 1.2kΩ: Manufacturer: UNI-ROYAL(厚声); Manufacturer Part: 0603WAF1201T5E; nameAlias: Value; Supplier: LCSC; Supplier Part: C22765; JLCPCB Part Class: Basic Part; spicePre: R; spiceSymbolName: 0603WAF1201T5E
RE1 RE2 = 10kΩ: Manufacturer: YAGEO(国巨); Manufacturer Part: RC0201FR-0710KL; nameAlias: Value; Contributor: LCSC; Supplier: LCSC; Supplier Part: C106225; JLCPCB Part Class: Extended Part; spicePre: R; spiceSymbolName: RC0201FR-0710KL
RE3 RE4 = 1MΩ: Manufacturer: YAGEO(国巨); Manufacturer Part: AF0201JR-071ML; nameAlias: Value; Contributor: LCSC; Supplier: LCSC; Supplier Part: C144007; JLCPCB Part Class: Extended Part; spicePre: R; spiceSymbolName: AF0201JR-071ML
RERRO1 RERRO2 RSDLIN1 = 100kΩ/30V: Manufacturer: VISHAY(威世); Manufacturer Part: CRCW0201100KFKED; Contributor: lcsc; nameAlias: Value; Supplier: LCSC; Supplier Part: C843835; JLCPCB Part Class: Extended Part; spicePre: U; spiceSymbolName: CRCW0201100KFKED
RISET = 25kΩ: Manufacturer: Viking(光颉); Manufacturer Part: AR03BTCX2502; nameAlias: Value; Contributor: LCSC; Supplier: LCSC; Supplier Part: C2828637; JLCPCB Part Class: Extended Part; spicePre: R; spiceSymbolName: AR03BTCX2502
RLQ1 RLQ2 RQH1 RQH2 = 15Ω: Manufacturer: UNI-ROYAL(厚声); Manufacturer Part: 0201WMJ0150TEE; nameAlias: Value; Contributor: LCSC; Supplier: LCSC; Supplier Part: C270330; JLCPCB Part Class: Extended Part; spicePre: R; spiceSymbolName: 0201WMJ0150TEE
RNTC = 10kΩ: Manufacturer: YAGEO(国巨); Manufacturer Part: RC0603FR-0710KL; nameAlias: Value; Supplier: LCSC; Supplier Part: C98220; JLCPCB Part Class: Extended Part; spicePre: R; spiceSymbolName: RC0603FR-0710KL
RQ1 = 6mΩ: Manufacturer: Viking(光颉); Manufacturer Part: LR12FTWSR006; nameAlias: Value; Contributor: 官方封装库; Supplier: LCSC; Supplier Part: C337227; JLCPCB Part Class: Extended Part; spicePre: R; spiceSymbolName: LR12FTWSR006
RQH3 RQL4 = 5.1Ω/25V: Manufacturer: YAGEO(国巨); Manufacturer Part: RC0201JR-075R1L; nameAlias: Value; Contributor: LCSC; Supplier: LCSC; Supplier Part: C309540; JLCPCB Part Class: Extended Part; spicePre: R; spiceSymbolName: RC0201JR-075R1L
RSC1 RSC2 = 10Ω: Manufacturer: UNI-ROYAL(厚声); Manufacturer Part: 0402WGF100JTCE; nameAlias: Value; Supplier: LCSC; Supplier Part: C25077; JLCPCB Part Class: Basic Part; spicePre: R; spiceSymbolName: 0402WGF100JTCE
RSCL1 = 5mΩ: Manufacturer: YAGEO(国巨); Manufacturer Part: PA1206DRF470R005L; Contributor: lcsc; nameAlias: Value; Supplier: LCSC; Supplier Part: C723507; JLCPCB Part Class: Extended Part; spicePre: R; spiceSymbolName: PA1206DRF470R005L
RSCR1 RSCR2 = 10mΩ: Manufacturer: PSA(信昌电陶); Manufacturer Part: FMF06FTHR010-LH; nameAlias: Value; Supplier: LCSC; Supplier Part: C105362; JLCPCB Part Class: Extended Part; spicePre: R; spiceSymbolName: FMF06FTHR010-LHL
RSDHIN1 RSDHIN2 = 10kΩ: Manufacturer: UNI-ROYAL(厚声); Manufacturer Part: 0201WMF1002TEE; nameAlias: Value; Contributor: LCSC; Supplier: LCSC; Supplier Part: C473048; JLCPCB Part Class: Extended Part; spicePre: R; spiceSymbolName: 0201WMF1002TEE
RSDLIN2 = 100kΩ/50V: Manufacturer: YAGEO(国巨); Manufacturer Part: RC0402FR-07100KL; nameAlias: Value; Supplier: LCSC; Supplier Part: C60491; JLCPCB Part Class: Extended Part; spicePre: R; spiceSymbolName: RC0402FR-07100KL
RVCC1 RVCC2 = 5.1Ω/50V: Manufacturer: UNI-ROYAL(厚声); Manufacturer Part: 0402WGF510KTCE; nameAlias: Value; Supplier: LCSC; Supplier Part: C25128; JLCPCB Part Class: Extended Part; spicePre: R; spiceSymbolName: 0402WGF510KTCE
RVSET = 10kΩ: Manufacturer: UNI-ROYAL(厚声); Manufacturer Part: 0603WAF1002T5E; nameAlias: Value; Supplier: LCSC; Supplier Part: C25804; JLCPCB Part Class: Basic Part; spicePre: R; spiceSymbolName: 0603WAF1002T5E
U8 U29 = EG1162: Manufacturer: EG(屹晶微); Contributor: LCSC; Supplier: LCSC; Supplier Part: C2929082; Manufacturer Part: EG1162; JLCPCB Part Class: Extended Part; spicePre: U; spiceSymbolName: EG1162
U26 = IP2368_BZ_VGLIP: Manufacturer: INJOINIC(英集芯); Contributor: lcsc; Supplier: LCSC; Supplier Part: C7545631; Manufacturer Part: IP2368_BZ_VGLIP; JLCPCB Part Class: Extended Part; spicePre: U; spiceSymbolName: IP2368_BZ_VGLIP
UPS VDET = XT30PW-M: Manufacturer: AMASS(艾迈斯); Manufacturer Part: XT30PW-M30.G.Y; Contributor: LCSC; Supplier: LCSC; Supplier Part: C431092; JLCPCB Part Class: Extended Part; spicePre: C; spiceSymbolName: XT30PW-M
USB1 = TYPE-C16PIN: Manufacturer: SHOU HAN(首韩); Contributor: LCSC; Supplier: LCSC; Supplier Part: C393939; Manufacturer Part: TYPE-C16PIN; JLCPCB Part Class: Extended Part; spicePre: U; spiceSymbolName: TYPE-C16PIN